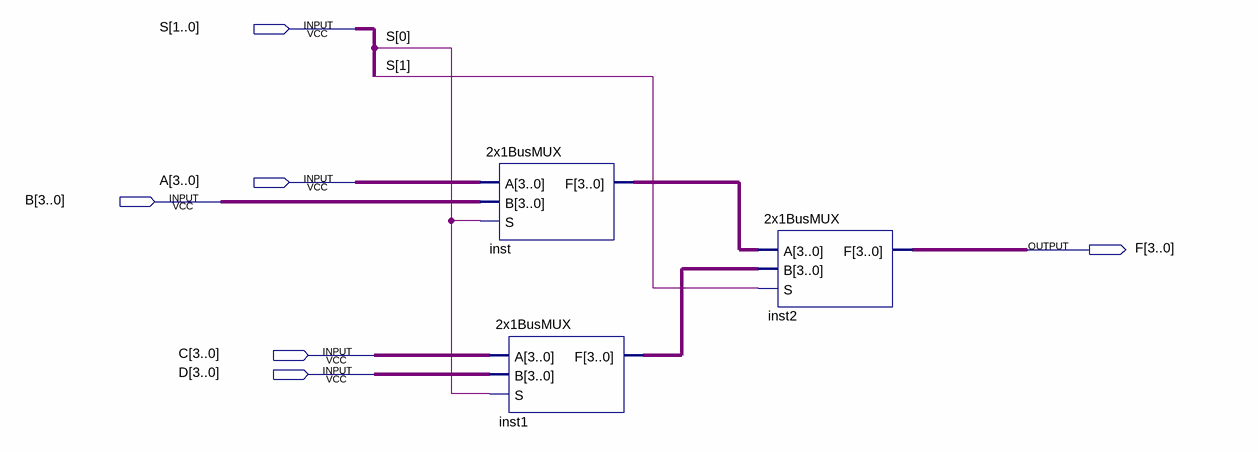
[diagram p0: schematic sheet]
// Quartus schematic 4x1BusMux.bdf as structural Verilog: 3 symbols, 6 pins
module \4x1BusMux  (
  input  [1:0] S,
  input  [3:0] A,
  input  [3:0] B,
  input  [3:0] C,
  input  [3:0] D,
  output [3:0] F
);

  wire [3:0] inst1_f, inst_f;

  \2x1BusMUX  inst (.A(A), .B(B), .S(S[0]), .F(inst_f));
  \2x1BusMUX  inst1 (.A(C), .B(D), .S(S[0]), .F(inst1_f));
  \2x1BusMUX  inst2 (.A(inst_f), .B(inst1_f), .S(S[1]), .F(F));
endmodule
